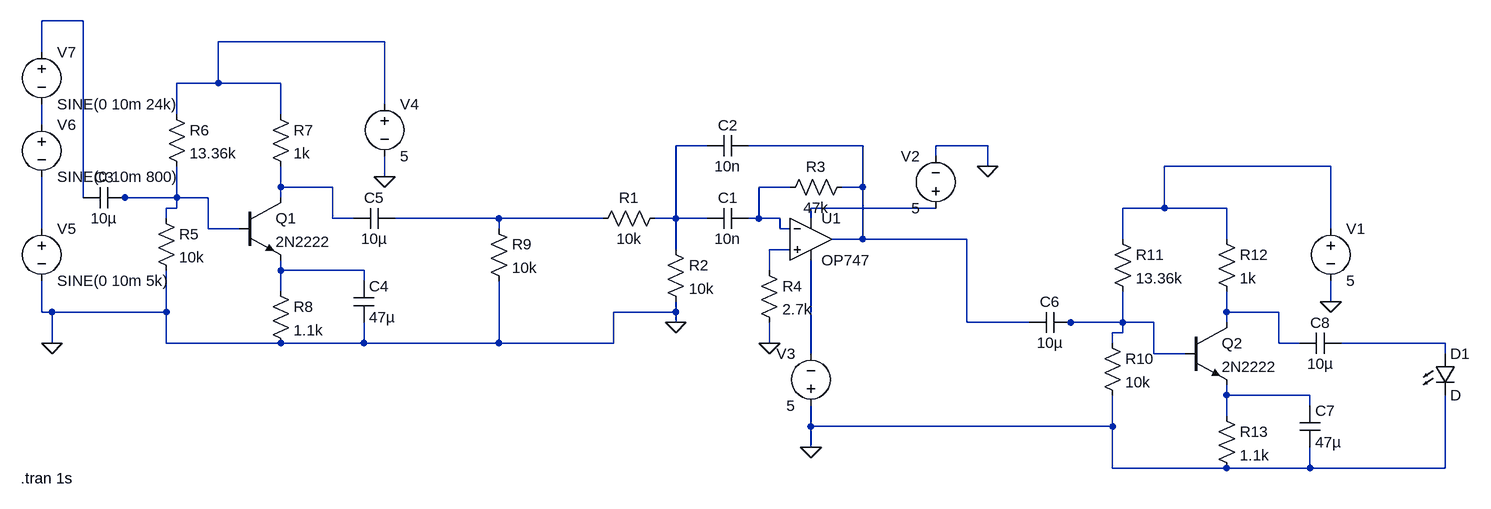
[diagram p0: schematic FILTER DESIGN 2.asc]
FILTER DESIGN 2.asc, the LTspice schematic file:
Version 4
SHEET 1 1476 680
WIRE -688 -176 -752 -176
WIRE -224 -144 -480 -144
WIRE -752 -128 -752 -176
WIRE -480 -80 -480 -144
WIRE -480 -80 -544 -80
WIRE -384 -80 -480 -80
WIRE -224 -48 -224 -144
WIRE -544 -32 -544 -80
WIRE -384 -32 -384 -80
WIRE -752 -16 -752 -48
WIRE 272 16 224 16
WIRE 512 16 336 16
WIRE 704 16 624 16
WIRE 624 32 624 16
WIRE 704 48 704 16
WIRE 1232 48 976 48
WIRE -224 64 -224 32
WIRE -384 80 -384 48
WIRE -304 80 -384 80
WIRE 400 80 352 80
WIRE 512 80 512 16
WIRE 512 80 480 80
WIRE -688 96 -688 -176
WIRE -624 96 -640 96
WIRE -544 96 -544 48
WIRE -544 96 -624 96
WIRE -496 96 -544 96
WIRE -384 96 -384 80
WIRE -544 112 -544 96
WIRE -544 112 -560 112
WIRE 624 112 432 112
WIRE 976 112 976 48
WIRE 976 112 912 112
WIRE 1072 112 976 112
WIRE -560 128 -560 112
WIRE -304 128 -304 80
WIRE -272 128 -304 128
WIRE -48 128 -208 128
WIRE 112 128 -48 128
WIRE 224 128 224 16
WIRE 224 128 192 128
WIRE 272 128 224 128
WIRE 352 128 352 80
WIRE 352 128 336 128
WIRE 384 128 352 128
WIRE 432 128 432 112
WIRE -752 144 -752 64
WIRE -496 144 -496 96
WIRE -448 144 -496 144
WIRE -48 144 -48 128
WIRE 384 144 384 128
WIRE 400 144 384 144
WIRE 1232 144 1232 48
WIRE 512 160 512 80
WIRE 512 160 464 160
WIRE 672 160 512 160
WIRE 912 160 912 112
WIRE 1072 160 1072 112
WIRE 224 176 224 128
WIRE 400 176 368 176
WIRE -384 208 -384 192
WIRE -256 208 -384 208
WIRE 368 208 368 176
WIRE -256 224 -256 208
WIRE -384 240 -384 208
WIRE 1232 256 1232 224
WIRE -752 272 -752 224
WIRE -736 272 -752 272
WIRE -560 272 -560 208
WIRE -560 272 -736 272
WIRE 224 272 224 256
WIRE 224 272 128 272
WIRE 1072 272 1072 240
WIRE 1152 272 1072 272
WIRE 224 288 224 272
WIRE 672 288 672 160
WIRE 768 288 672 288
WIRE 832 288 816 288
WIRE 912 288 912 240
WIRE 912 288 832 288
WIRE 960 288 912 288
WIRE 1072 288 1072 272
WIRE 912 304 912 288
WIRE 912 304 896 304
WIRE -736 320 -736 272
WIRE -560 320 -560 272
WIRE -384 320 -560 320
WIRE -256 320 -256 288
WIRE -256 320 -384 320
WIRE -48 320 -48 224
WIRE -48 320 -256 320
WIRE 128 320 128 272
WIRE 128 320 -48 320
WIRE 368 320 368 288
WIRE 896 320 896 304
WIRE 1152 320 1152 272
WIRE 1184 320 1152 320
WIRE 1408 320 1248 320
WIRE 432 336 432 192
WIRE 960 336 960 288
WIRE 1008 336 960 336
WIRE 1408 336 1408 320
WIRE 1072 400 1072 384
WIRE 1200 400 1072 400
WIRE 1200 416 1200 400
WIRE 1072 432 1072 400
WIRE 432 448 432 416
WIRE 896 448 896 400
WIRE 896 448 432 448
WIRE 432 480 432 448
WIRE 896 512 896 448
WIRE 1072 512 896 512
WIRE 1200 512 1200 480
WIRE 1200 512 1072 512
WIRE 1408 512 1408 400
WIRE 1408 512 1200 512
FLAG 224 288 0
FLAG 368 320 0
FLAG 704 48 0
FLAG 432 480 0
FLAG -224 64 0
FLAG -736 320 0
FLAG 1232 256 0
SYMBOL res 208 112 R90
WINDOW 0 0 56 VBottom 2
WINDOW 3 32 56 VTop 2
SYMATTR InstName R1
SYMATTR Value 10k
SYMBOL res 208 160 R0
SYMATTR InstName R2
SYMATTR Value 10k
SYMBOL cap 336 112 R90
WINDOW 0 0 32 VBottom 2
WINDOW 3 32 32 VTop 2
SYMATTR InstName C1
SYMATTR Value 10n
SYMBOL cap 336 0 R90
WINDOW 0 0 32 VBottom 2
WINDOW 3 32 32 VTop 2
SYMATTR InstName C2
SYMATTR Value 10n
SYMBOL res 496 64 R90
WINDOW 0 0 56 VBottom 2
WINDOW 3 32 56 VTop 2
SYMATTR InstName R3
SYMATTR Value 47k
SYMBOL OpAmps\\OP747 432 96 R0
SYMATTR InstName U1
SYMBOL res 352 192 R0
SYMATTR InstName R4
SYMATTR Value 2.7k
SYMBOL voltage 624 128 R180
WINDOW 0 24 96 Left 2
WINDOW 3 24 16 Left 2
WINDOW 123 0 0 Left 0
WINDOW 39 0 0 Left 0
SYMATTR InstName V2
SYMATTR Value 5
SYMBOL voltage 432 432 R180
WINDOW 0 24 96 Left 2
WINDOW 3 24 16 Left 2
WINDOW 123 0 0 Left 0
WINDOW 39 0 0 Left 0
SYMATTR InstName V3
SYMATTR Value 5
SYMBOL cap -624 80 R90
WINDOW 0 0 32 VBottom 2
WINDOW 3 32 32 VTop 2
SYMATTR InstName C3
SYMATTR Value 10µ
SYMBOL res -576 112 R0
SYMATTR InstName R5
SYMATTR Value 10k
SYMBOL res -560 -48 R0
SYMATTR InstName R6
SYMATTR Value 13.36k
SYMBOL res -400 -48 R0
SYMATTR InstName R7
SYMATTR Value 1k
SYMBOL res -400 224 R0
SYMATTR InstName R8
SYMATTR Value 1.1k
SYMBOL npn -448 96 R0
SYMATTR InstName Q1
SYMATTR Value 2N2222
SYMBOL voltage -224 -64 R0
WINDOW 123 0 0 Left 0
WINDOW 39 0 0 Left 0
SYMATTR InstName V4
SYMATTR Value 5
SYMBOL cap -272 224 R0
SYMATTR InstName C4
SYMATTR Value 47µ
SYMBOL cap -208 112 R90
WINDOW 0 0 32 VBottom 2
WINDOW 3 32 32 VTop 2
SYMATTR InstName C5
SYMATTR Value 10µ
SYMBOL res -64 128 R0
SYMATTR InstName R9
SYMATTR Value 10k
SYMBOL voltage -752 128 R0
WINDOW 123 0 0 Left 0
WINDOW 39 0 0 Left 0
SYMATTR InstName V5
SYMATTR Value SINE(0 10m 5k)
SYMBOL cap 832 272 R90
WINDOW 0 0 32 VBottom 2
WINDOW 3 32 32 VTop 2
SYMATTR InstName C6
SYMATTR Value 10µ
SYMBOL res 880 304 R0
SYMATTR InstName R10
SYMATTR Value 10k
SYMBOL res 896 144 R0
SYMATTR InstName R11
SYMATTR Value 13.36k
SYMBOL res 1056 144 R0
SYMATTR InstName R12
SYMATTR Value 1k
SYMBOL res 1056 416 R0
SYMATTR InstName R13
SYMATTR Value 1.1k
SYMBOL npn 1008 288 R0
SYMATTR InstName Q2
SYMATTR Value 2N2222
SYMBOL voltage 1232 128 R0
WINDOW 123 0 0 Left 0
WINDOW 39 0 0 Left 0
SYMATTR InstName V1
SYMATTR Value 5
SYMBOL cap 1184 416 R0
SYMATTR InstName C7
SYMATTR Value 47µ
SYMBOL cap 1248 304 R90
WINDOW 0 0 32 VBottom 2
WINDOW 3 32 32 VTop 2
SYMATTR InstName C8
SYMATTR Value 10µ
SYMBOL voltage -752 -32 R0
WINDOW 123 0 0 Left 0
WINDOW 39 0 0 Left 0
SYMATTR InstName V6
SYMATTR Value SINE(0 10m 800)
SYMBOL voltage -752 -144 R0
WINDOW 123 0 0 Left 0
WINDOW 39 0 0 Left 0
SYMATTR InstName V7
SYMATTR Value SINE(0 10m 24k)
SYMBOL LED 1392 336 R0
SYMATTR InstName D1
TEXT -784 528 Left 2 !.tran 1s

The netlist it stands for:
* FILTER DESIGN 2.asc
R1 N004 N011 10k
R2 N004 0 10k
C1 N008 N004 10n
C2 N005 N004 10n
R3 N005 N008 47k
XU1 N013 N008 N010 N018 N005 OP747  ; pins In+ In- V+ V- OUT
R4 N013 0 2.7k
V2 N010 0 5
V3 0 N018 5
C3 N009 N001 10µ
R5 N009 0 10k
R6 N002 N009 13.36k
R7 N002 N007 1k
R8 N014 0 1.1k
Q1 N007 N009 N014 0 2N2222
V4 N002 0 5
C4 N014 0 47µ
C5 N011 N007 10µ
R9 N011 0 10k
V5 N012 0 SINE(0 10m 5k)
C6 N016 N005 10µ
R10 N016 0 10k
R11 N006 N016 13.36k
R12 N006 N015 1k
R13 N019 0 1.1k
Q2 N015 N016 N019 0 2N2222
V1 N006 0 5
C7 N019 0 47µ
C8 N017 N015 10µ
V6 N003 N012 SINE(0 10m 800)
V7 N001 N003 SINE(0 10m 24k)
D1 N017 0 D
.model D D
.lib standard.dio
.model NPN NPN
.model PNP PNP
.lib standard.bjt
.tran 1s
.backanno
.end